# Altium project DIOT_Backplane.PrjPCB (part 2 of 3)
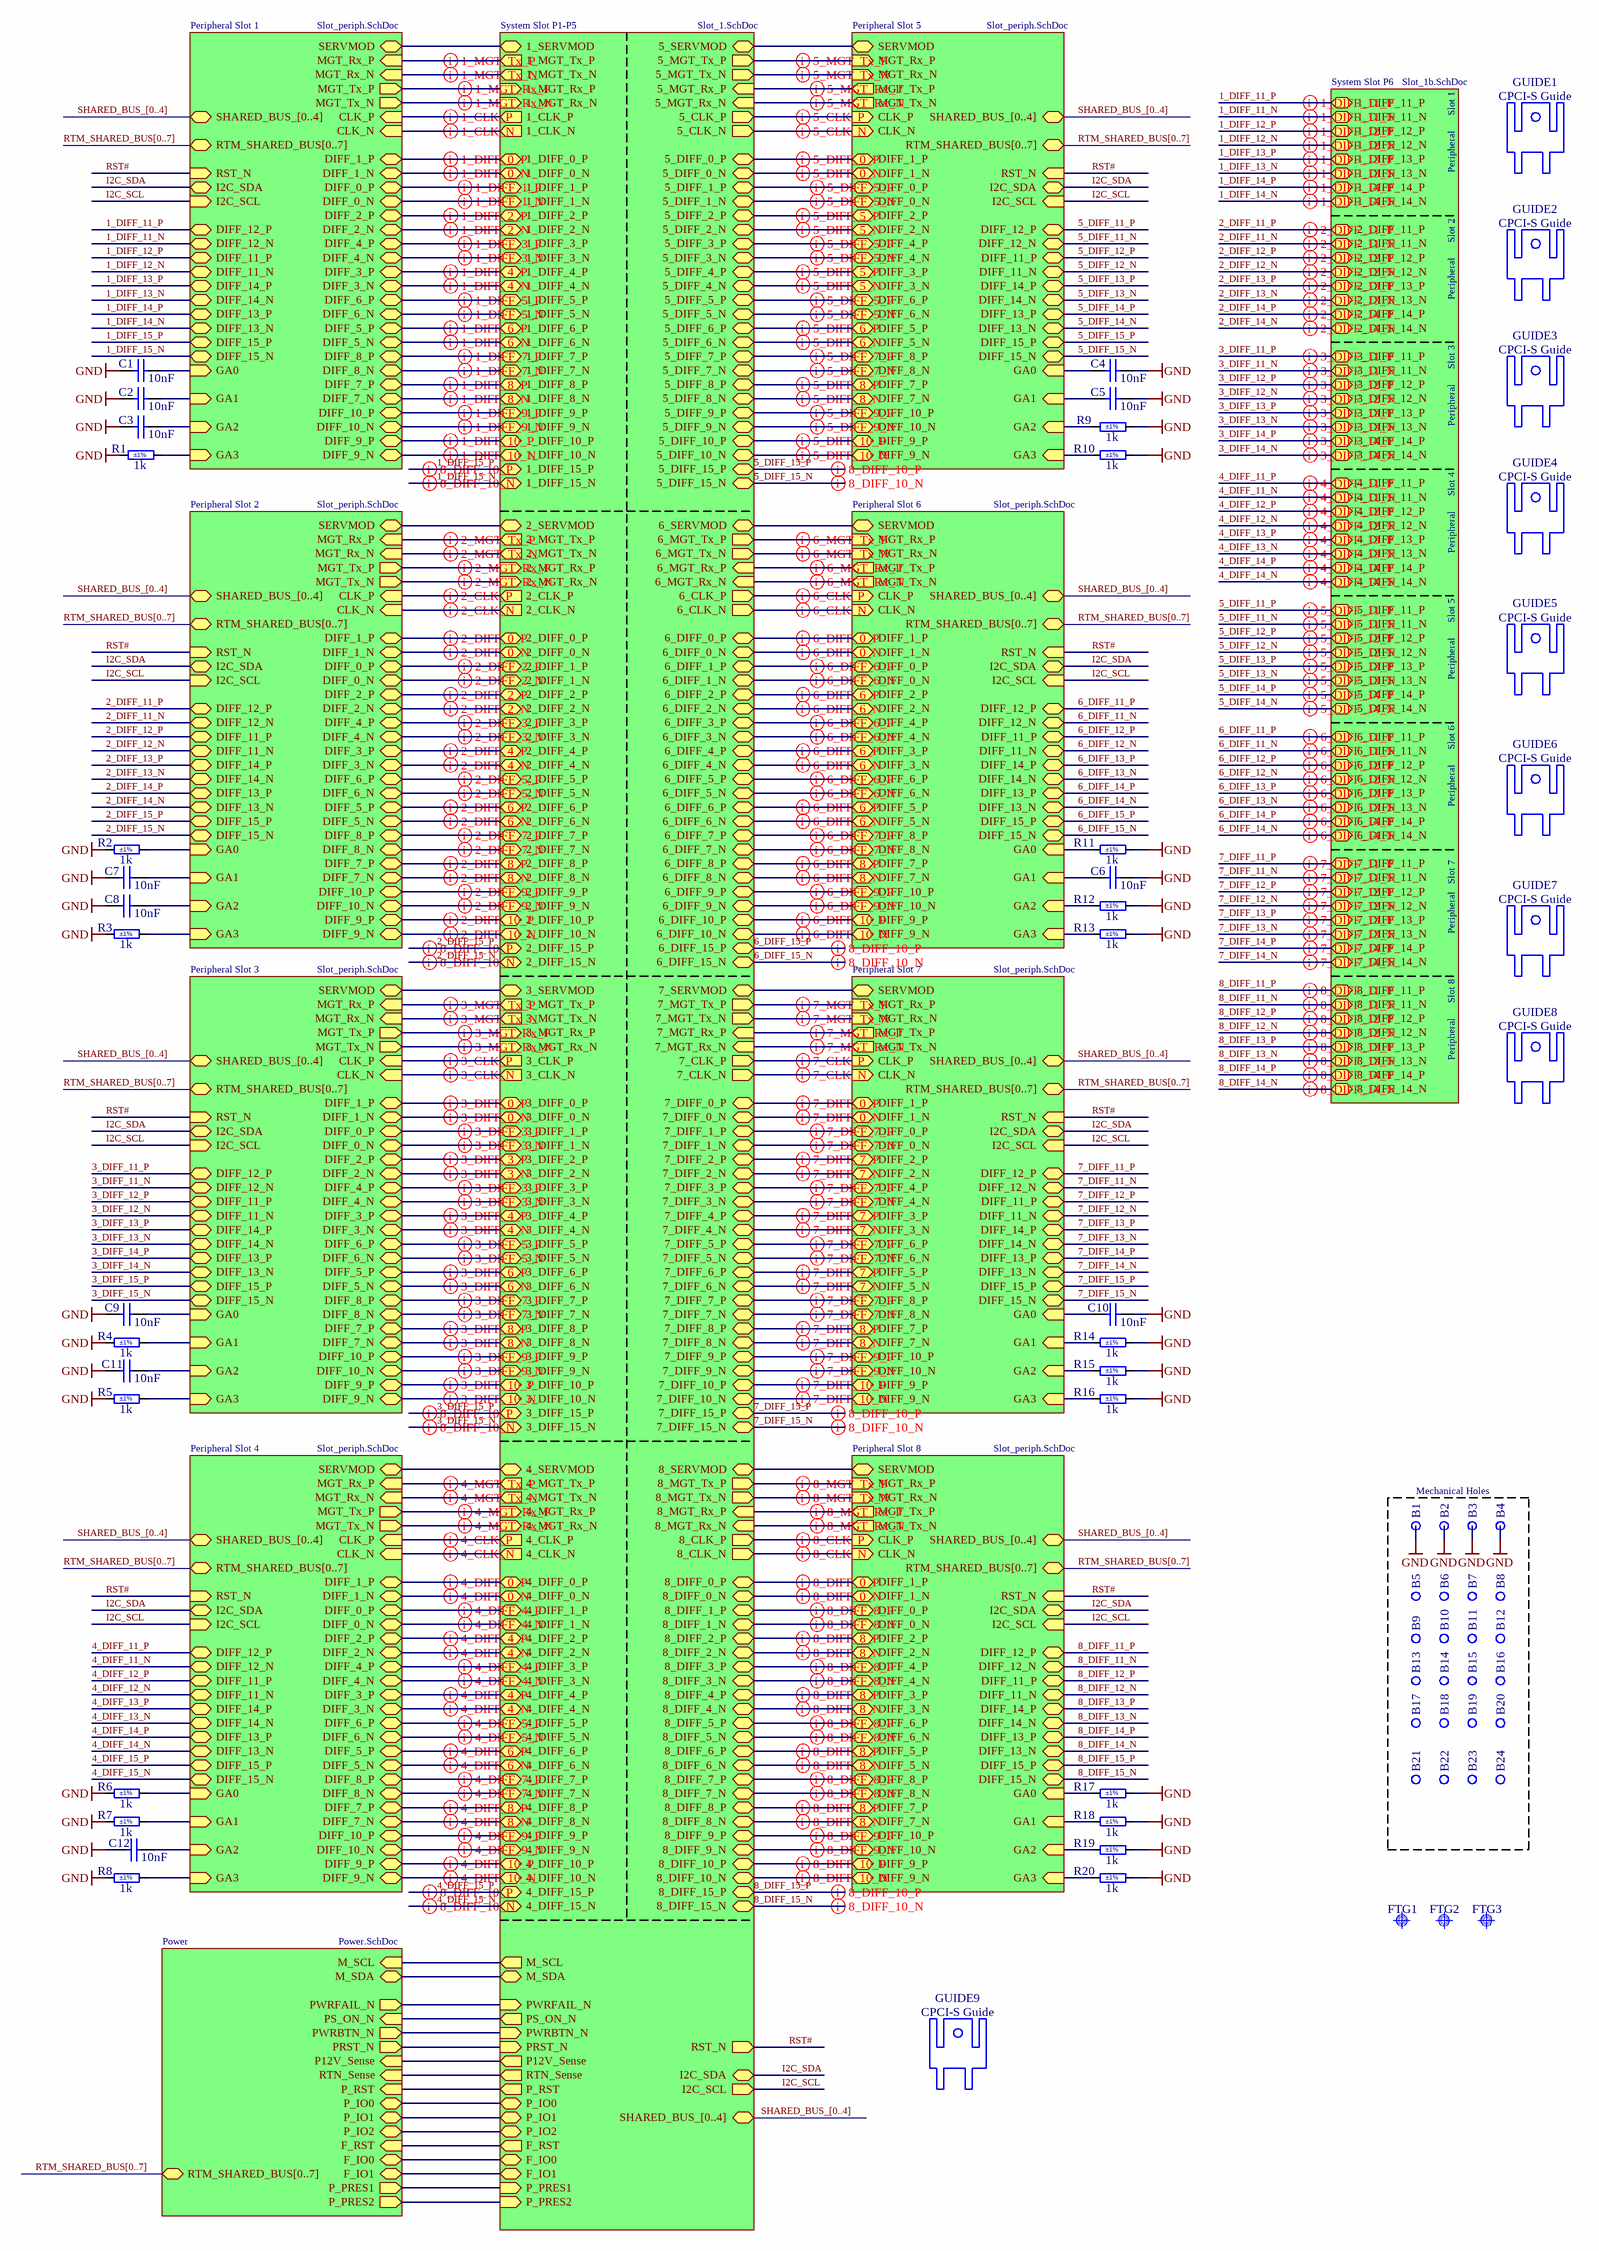
[diagram p3: DIOT_Backplane.SchDoc]

## Sheet DIOT_Backplane.SchDoc: =title_ (continued)

### Nets
GND: B1.1 B2.1 B3.1 B4.1 C1.1 C2.1 C3.1 C4.2 C5.2 C6.2 C7.1 C8.1 C9.1 C10.2 C11.1 C12.1 R1.1 R2.1 R3.1 R4.1 R5.1 R6.1 R7.1 R8.1 R9.2 R10.2 R11.2 R12.2 R13.2 R14.2 R15.2 R16.2 R17.2 R18.2 R19.2 R20.2
1_DIFF_11_N: sheet System Slot P6/1_DIFF_11_N, sheet Peripheral Slot 1/DIFF_12_N
1_DIFF_11_P: sheet System Slot P6/1_DIFF_11_P, sheet Peripheral Slot 1/DIFF_12_P
1_DIFF_12_N: sheet System Slot P6/1_DIFF_12_N, sheet Peripheral Slot 1/DIFF_11_N
1_DIFF_12_P: sheet System Slot P6/1_DIFF_12_P, sheet Peripheral Slot 1/DIFF_11_P
1_DIFF_13_N: sheet System Slot P6/1_DIFF_13_N, sheet Peripheral Slot 1/DIFF_14_N
1_DIFF_13_P: sheet System Slot P6/1_DIFF_13_P, sheet Peripheral Slot 1/DIFF_14_P
1_DIFF_14_N: sheet System Slot P6/1_DIFF_14_N, sheet Peripheral Slot 1/DIFF_13_N
1_DIFF_14_P: sheet System Slot P6/1_DIFF_14_P, sheet Peripheral Slot 1/DIFF_13_P
1_DIFF_15_N: sheet System Slot P1-P5/1_DIFF_15_N, sheet Peripheral Slot 1/DIFF_15_N
1_DIFF_15_P: sheet System Slot P1-P5/1_DIFF_15_P, sheet Peripheral Slot 1/DIFF_15_P
2_DIFF_11_N: sheet System Slot P6/2_DIFF_11_N, sheet Peripheral Slot 2/DIFF_12_N
2_DIFF_11_P: sheet System Slot P6/2_DIFF_11_P, sheet Peripheral Slot 2/DIFF_12_P
2_DIFF_12_N: sheet System Slot P6/2_DIFF_12_N, sheet Peripheral Slot 2/DIFF_11_N
2_DIFF_12_P: sheet System Slot P6/2_DIFF_12_P, sheet Peripheral Slot 2/DIFF_11_P
2_DIFF_13_N: sheet System Slot P6/2_DIFF_13_N, sheet Peripheral Slot 2/DIFF_14_N
2_DIFF_13_P: sheet System Slot P6/2_DIFF_13_P, sheet Peripheral Slot 2/DIFF_14_P
2_DIFF_14_N: sheet System Slot P6/2_DIFF_14_N, sheet Peripheral Slot 2/DIFF_13_N
2_DIFF_14_P: sheet System Slot P6/2_DIFF_14_P, sheet Peripheral Slot 2/DIFF_13_P
2_DIFF_15_N: sheet System Slot P1-P5/2_DIFF_15_N, sheet Peripheral Slot 2/DIFF_15_N
2_DIFF_15_P: sheet System Slot P1-P5/2_DIFF_15_P, sheet Peripheral Slot 2/DIFF_15_P
3_DIFF_11_N: sheet System Slot P6/3_DIFF_11_N, sheet Peripheral Slot 3/DIFF_12_N
3_DIFF_11_P: sheet System Slot P6/3_DIFF_11_P, sheet Peripheral Slot 3/DIFF_12_P
3_DIFF_12_N: sheet System Slot P6/3_DIFF_12_N, sheet Peripheral Slot 3/DIFF_11_N
3_DIFF_12_P: sheet System Slot P6/3_DIFF_12_P, sheet Peripheral Slot 3/DIFF_11_P
3_DIFF_13_N: sheet System Slot P6/3_DIFF_13_N, sheet Peripheral Slot 3/DIFF_14_N
3_DIFF_13_P: sheet System Slot P6/3_DIFF_13_P, sheet Peripheral Slot 3/DIFF_14_P
3_DIFF_14_N: sheet System Slot P6/3_DIFF_14_N, sheet Peripheral Slot 3/DIFF_13_N
3_DIFF_14_P: sheet System Slot P6/3_DIFF_14_P, sheet Peripheral Slot 3/DIFF_13_P
3_DIFF_15_N: sheet System Slot P1-P5/3_DIFF_15_N, sheet Peripheral Slot 3/DIFF_15_N
3_DIFF_15_P: sheet System Slot P1-P5/3_DIFF_15_P, sheet Peripheral Slot 3/DIFF_15_P
4_DIFF_11_N: sheet System Slot P6/4_DIFF_11_N, sheet Peripheral Slot 4/DIFF_12_N
4_DIFF_11_P: sheet System Slot P6/4_DIFF_11_P, sheet Peripheral Slot 4/DIFF_12_P
4_DIFF_12_N: sheet System Slot P6/4_DIFF_12_N, sheet Peripheral Slot 4/DIFF_11_N
4_DIFF_12_P: sheet System Slot P6/4_DIFF_12_P, sheet Peripheral Slot 4/DIFF_11_P
4_DIFF_13_N: sheet System Slot P6/4_DIFF_13_N, sheet Peripheral Slot 4/DIFF_14_N
4_DIFF_13_P: sheet System Slot P6/4_DIFF_13_P, sheet Peripheral Slot 4/DIFF_14_P
4_DIFF_14_N: sheet System Slot P6/4_DIFF_14_N, sheet Peripheral Slot 4/DIFF_13_N
4_DIFF_14_P: sheet System Slot P6/4_DIFF_14_P, sheet Peripheral Slot 4/DIFF_13_P
4_DIFF_15_N: sheet System Slot P1-P5/4_DIFF_15_N, sheet Peripheral Slot 4/DIFF_15_N
4_DIFF_15_P: sheet System Slot P1-P5/4_DIFF_15_P, sheet Peripheral Slot 4/DIFF_15_P
5_DIFF_11_N: sheet System Slot P6/5_DIFF_11_N, sheet Peripheral Slot 5/DIFF_12_N
5_DIFF_11_P: sheet System Slot P6/5_DIFF_11_P, sheet Peripheral Slot 5/DIFF_12_P
5_DIFF_12_N: sheet System Slot P6/5_DIFF_12_N, sheet Peripheral Slot 5/DIFF_11_N
5_DIFF_12_P: sheet System Slot P6/5_DIFF_12_P, sheet Peripheral Slot 5/DIFF_11_P
5_DIFF_13_N: sheet System Slot P6/5_DIFF_13_N, sheet Peripheral Slot 5/DIFF_14_N
5_DIFF_13_P: sheet System Slot P6/5_DIFF_13_P, sheet Peripheral Slot 5/DIFF_14_P
5_DIFF_14_N: sheet System Slot P6/5_DIFF_14_N, sheet Peripheral Slot 5/DIFF_13_N
5_DIFF_14_P: sheet System Slot P6/5_DIFF_14_P, sheet Peripheral Slot 5/DIFF_13_P
5_DIFF_15_N: sheet System Slot P1-P5/5_DIFF_15_N, sheet Peripheral Slot 5/DIFF_15_N
5_DIFF_15_P: sheet System Slot P1-P5/5_DIFF_15_P, sheet Peripheral Slot 5/DIFF_15_P
6_DIFF_11_N: sheet System Slot P6/6_DIFF_11_N, sheet Peripheral Slot 6/DIFF_12_N
6_DIFF_11_P: sheet System Slot P6/6_DIFF_11_P, sheet Peripheral Slot 6/DIFF_12_P
6_DIFF_12_N: sheet System Slot P6/6_DIFF_12_N, sheet Peripheral Slot 6/DIFF_11_N
6_DIFF_12_P: sheet System Slot P6/6_DIFF_12_P, sheet Peripheral Slot 6/DIFF_11_P
6_DIFF_13_N: sheet System Slot P6/6_DIFF_13_N, sheet Peripheral Slot 6/DIFF_14_N
6_DIFF_13_P: sheet System Slot P6/6_DIFF_13_P, sheet Peripheral Slot 6/DIFF_14_P
6_DIFF_14_N: sheet System Slot P6/6_DIFF_14_N, sheet Peripheral Slot 6/DIFF_13_N
6_DIFF_14_P: sheet System Slot P6/6_DIFF_14_P, sheet Peripheral Slot 6/DIFF_13_P
6_DIFF_15_N: sheet System Slot P1-P5/6_DIFF_15_N, sheet Peripheral Slot 6/DIFF_15_N
6_DIFF_15_P: sheet System Slot P1-P5/6_DIFF_15_P, sheet Peripheral Slot 6/DIFF_15_P
7_DIFF_11_N: sheet System Slot P6/7_DIFF_11_N, sheet Peripheral Slot 7/DIFF_12_N
7_DIFF_11_P: sheet System Slot P6/7_DIFF_11_P, sheet Peripheral Slot 7/DIFF_12_P
7_DIFF_12_N: sheet System Slot P6/7_DIFF_12_N, sheet Peripheral Slot 7/DIFF_11_N
7_DIFF_12_P: sheet System Slot P6/7_DIFF_12_P, sheet Peripheral Slot 7/DIFF_11_P
7_DIFF_13_N: sheet System Slot P6/7_DIFF_13_N, sheet Peripheral Slot 7/DIFF_14_N
7_DIFF_13_P: sheet System Slot P6/7_DIFF_13_P, sheet Peripheral Slot 7/DIFF_14_P
7_DIFF_14_N: sheet System Slot P6/7_DIFF_14_N, sheet Peripheral Slot 7/DIFF_13_N
7_DIFF_14_P: sheet System Slot P6/7_DIFF_14_P, sheet Peripheral Slot 7/DIFF_13_P
7_DIFF_15_N: sheet System Slot P1-P5/7_DIFF_15_N, sheet Peripheral Slot 7/DIFF_15_N
7_DIFF_15_P: sheet System Slot P1-P5/7_DIFF_15_P, sheet Peripheral Slot 7/DIFF_15_P
8_DIFF_11_N: sheet System Slot P6/8_DIFF_11_N, sheet Peripheral Slot 8/DIFF_12_N
8_DIFF_11_P: sheet System Slot P6/8_DIFF_11_P, sheet Peripheral Slot 8/DIFF_12_P
8_DIFF_12_N: sheet System Slot P6/8_DIFF_12_N, sheet Peripheral Slot 8/DIFF_11_N
8_DIFF_12_P: sheet System Slot P6/8_DIFF_12_P, sheet Peripheral Slot 8/DIFF_11_P
8_DIFF_13_N: sheet System Slot P6/8_DIFF_13_N, sheet Peripheral Slot 8/DIFF_14_N
8_DIFF_13_P: sheet System Slot P6/8_DIFF_13_P, sheet Peripheral Slot 8/DIFF_14_P
8_DIFF_14_N: sheet System Slot P6/8_DIFF_14_N, sheet Peripheral Slot 8/DIFF_13_N
8_DIFF_14_P: sheet System Slot P6/8_DIFF_14_P, sheet Peripheral Slot 8/DIFF_13_P
8_DIFF_15_N: sheet System Slot P1-P5/8_DIFF_15_N, sheet Peripheral Slot 8/DIFF_15_N
8_DIFF_15_P: sheet System Slot P1-P5/8_DIFF_15_P, sheet Peripheral Slot 8/DIFF_15_P
F_IO0: sheet Power/F_IO0, sheet System Slot P1-P5/F_IO0
F_IO1: sheet Power/F_IO1, sheet System Slot P1-P5/F_IO1
F_RST: sheet Power/F_RST, sheet System Slot P1-P5/F_RST
I2C_SCL: sheet System Slot P1-P5/I2C_SCL, sheet Peripheral Slot 3/I2C_SCL, sheet Peripheral Slot 4/I2C_SCL, sheet Peripheral Slot 6/I2C_SCL, sheet Peripheral Slot 7/I2C_SCL, sheet Peripheral Slot 8/I2C_SCL, sheet Peripheral Slot 2/I2C_SCL, sheet Peripheral Slot 5/I2C_SCL, sheet Peripheral Slot 1/I2C_SCL
I2C_SDA: sheet System Slot P1-P5/I2C_SDA, sheet Peripheral Slot 3/I2C_SDA, sheet Peripheral Slot 4/I2C_SDA, sheet Peripheral Slot 6/I2C_SDA, sheet Peripheral Slot 7/I2C_SDA, sheet Peripheral Slot 8/I2C_SDA, sheet Peripheral Slot 2/I2C_SDA, sheet Peripheral Slot 5/I2C_SDA, sheet Peripheral Slot 1/I2C_SDA
M_SCL: sheet Power/M_SCL, sheet System Slot P1-P5/M_SCL
M_SDA: sheet Power/M_SDA, sheet System Slot P1-P5/M_SDA
P12V_Sense: sheet Power/P12V_Sense, sheet System Slot P1-P5/P12V_Sense
P_IO0: sheet Power/P_IO0, sheet System Slot P1-P5/P_IO0
P_IO1: sheet Power/P_IO1, sheet System Slot P1-P5/P_IO1
P_IO2: sheet Power/P_IO2, sheet System Slot P1-P5/P_IO2
P_PRES1: sheet Power/P_PRES1, sheet System Slot P1-P5/P_PRES1
P_PRES2: sheet Power/P_PRES2, sheet System Slot P1-P5/P_PRES2
P_RST: sheet Power/P_RST, sheet System Slot P1-P5/P_RST
PRST_N: sheet Power/PRST_N, sheet System Slot P1-P5/PRST_N
PS_ON_N: sheet Power/PS_ON_N, sheet System Slot P1-P5/PS_ON_N
PWRBTN_N: sheet Power/PWRBTN_N, sheet System Slot P1-P5/PWRBTN_N
PWRFAIL_N: sheet Power/PWRFAIL_N, sheet System Slot P1-P5/PWRFAIL_N
RST#: sheet System Slot P1-P5/RST_N, sheet Peripheral Slot 3/RST_N, sheet Peripheral Slot 4/RST_N, sheet Peripheral Slot 6/RST_N, sheet Peripheral Slot 7/RST_N, sheet Peripheral Slot 8/RST_N, sheet Peripheral Slot 2/RST_N, sheet Peripheral Slot 5/RST_N, sheet Peripheral Slot 1/RST_N
RTN_Sense: sheet Power/RTN_Sense, sheet System Slot P1-P5/RTN_Sense
NetC1_2: C1.2 ; sheet Peripheral Slot 1/GA0
NetC2_2: C2.2 ; sheet Peripheral Slot 1/GA1
NetC3_2: C3.2 ; sheet Peripheral Slot 1/GA2
NetC4_1: C4.1 ; sheet Peripheral Slot 5/GA0
NetC5_1: C5.1 ; sheet Peripheral Slot 5/GA1
NetC6_1: C6.1 ; sheet Peripheral Slot 6/GA1
NetC7_2: C7.2 ; sheet Peripheral Slot 2/GA1
NetC8_2: C8.2 ; sheet Peripheral Slot 2/GA2
NetC9_2: C9.2 ; sheet Peripheral Slot 3/GA0
NetC10_1: C10.1 ; sheet Peripheral Slot 7/GA0
NetC11_2: C11.2 ; sheet Peripheral Slot 3/GA2
NetC12_2: C12.2 ; sheet Peripheral Slot 4/GA2
NetR1_2: R1.2 ; sheet Peripheral Slot 1/GA3
NetR2_2: R2.2 ; sheet Peripheral Slot 2/GA0
NetR3_2: R3.2 ; sheet Peripheral Slot 2/GA3
NetR4_2: R4.2 ; sheet Peripheral Slot 3/GA1
NetR5_2: R5.2 ; sheet Peripheral Slot 3/GA3
NetR6_2: R6.2 ; sheet Peripheral Slot 4/GA0
NetR7_2: R7.2 ; sheet Peripheral Slot 4/GA1
NetR8_2: R8.2 ; sheet Peripheral Slot 4/GA3
NetR9_1: R9.1 ; sheet Peripheral Slot 5/GA2
NetR10_1: R10.1 ; sheet Peripheral Slot 5/GA3
NetR11_1: R11.1 ; sheet Peripheral Slot 6/GA0
NetR12_1: R12.1 ; sheet Peripheral Slot 6/GA2
NetR13_1: R13.1 ; sheet Peripheral Slot 6/GA3
NetR14_1: R14.1 ; sheet Peripheral Slot 7/GA1
NetR15_1: R15.1 ; sheet Peripheral Slot 7/GA2
NetR16_1: R16.1 ; sheet Peripheral Slot 7/GA3
NetR17_1: R17.1 ; sheet Peripheral Slot 8/GA0
NetR18_1: R18.1 ; sheet Peripheral Slot 8/GA1
NetR19_1: R19.1 ; sheet Peripheral Slot 8/GA2
NetR20_1: R20.1 ; sheet Peripheral Slot 8/GA3
(unnamed): sheet System Slot P1-P5/1_SERVMOD, sheet Peripheral Slot 1/SERVMOD
(unnamed): sheet System Slot P1-P5/2_CLK_P, sheet Peripheral Slot 2/CLK_P
(unnamed): sheet System Slot P1-P5/2_CLK_N, sheet Peripheral Slot 2/CLK_N
(unnamed): sheet System Slot P1-P5/2_SERVMOD, sheet Peripheral Slot 2/SERVMOD
(unnamed): sheet System Slot P1-P5/3_CLK_P, sheet Peripheral Slot 3/CLK_P
(unnamed): sheet System Slot P1-P5/3_CLK_N, sheet Peripheral Slot 3/CLK_N
(unnamed): sheet System Slot P1-P5/3_SERVMOD, sheet Peripheral Slot 3/SERVMOD
(unnamed): sheet System Slot P1-P5/4_CLK_P, sheet Peripheral Slot 4/CLK_P
(unnamed): sheet System Slot P1-P5/4_CLK_N, sheet Peripheral Slot 4/CLK_N
(unnamed): sheet System Slot P1-P5/4_SERVMOD, sheet Peripheral Slot 4/SERVMOD
(unnamed): sheet System Slot P1-P5/5_SERVMOD, sheet Peripheral Slot 5/SERVMOD
(unnamed): sheet System Slot P1-P5/5_CLK_P, sheet Peripheral Slot 5/CLK_P
(unnamed): sheet System Slot P1-P5/6_SERVMOD, sheet Peripheral Slot 6/SERVMOD
(unnamed): sheet System Slot P1-P5/5_CLK_N, sheet Peripheral Slot 5/CLK_N
(unnamed): sheet System Slot P1-P5/6_CLK_P, sheet Peripheral Slot 6/CLK_P
(unnamed): sheet System Slot P1-P5/6_CLK_N, sheet Peripheral Slot 6/CLK_N
(unnamed): sheet System Slot P1-P5/7_SERVMOD, sheet Peripheral Slot 7/SERVMOD
(unnamed): sheet System Slot P1-P5/7_CLK_P, sheet Peripheral Slot 7/CLK_P
(unnamed): sheet System Slot P1-P5/7_CLK_N, sheet Peripheral Slot 7/CLK_N
(unnamed): sheet System Slot P1-P5/8_SERVMOD, sheet Peripheral Slot 8/SERVMOD
(unnamed): sheet System Slot P1-P5/8_CLK_P, sheet Peripheral Slot 8/CLK_P
(unnamed): sheet System Slot P1-P5/8_CLK_N, sheet Peripheral Slot 8/CLK_N
(unnamed): sheet System Slot P1-P5/1_CLK_N, sheet Peripheral Slot 1/CLK_N
(unnamed): sheet System Slot P1-P5/1_CLK_P, sheet Peripheral Slot 1/CLK_P
(unnamed): sheet System Slot P1-P5/2_DIFF_0_P, sheet Peripheral Slot 2/DIFF_1_P
(unnamed): sheet System Slot P1-P5/2_DIFF_0_N, sheet Peripheral Slot 2/DIFF_1_N
(unnamed): sheet System Slot P1-P5/2_DIFF_1_P, sheet Peripheral Slot 2/DIFF_0_P
(unnamed): sheet System Slot P1-P5/2_DIFF_1_N, sheet Peripheral Slot 2/DIFF_0_N
(unnamed): sheet System Slot P1-P5/3_DIFF_0_P, sheet Peripheral Slot 3/DIFF_1_P
(unnamed): sheet System Slot P1-P5/3_DIFF_0_N, sheet Peripheral Slot 3/DIFF_1_N
(unnamed): sheet System Slot P1-P5/3_DIFF_1_P, sheet Peripheral Slot 3/DIFF_0_P
(unnamed): sheet System Slot P1-P5/3_DIFF_1_N, sheet Peripheral Slot 3/DIFF_0_N
(unnamed): sheet System Slot P1-P5/4_DIFF_0_P, sheet Peripheral Slot 4/DIFF_1_P
(unnamed): sheet System Slot P1-P5/4_DIFF_0_N, sheet Peripheral Slot 4/DIFF_1_N
(unnamed): sheet System Slot P1-P5/4_DIFF_1_P, sheet Peripheral Slot 4/DIFF_0_P
(unnamed): sheet System Slot P1-P5/4_DIFF_1_N, sheet Peripheral Slot 4/DIFF_0_N
(unnamed): sheet System Slot P1-P5/5_DIFF_0_P, sheet Peripheral Slot 5/DIFF_1_P
(unnamed): sheet System Slot P1-P5/5_DIFF_0_N, sheet Peripheral Slot 5/DIFF_1_N
(unnamed): sheet System Slot P1-P5/5_DIFF_1_P, sheet Peripheral Slot 5/DIFF_0_P
(unnamed): sheet System Slot P1-P5/5_DIFF_1_N, sheet Peripheral Slot 5/DIFF_0_N
(unnamed): sheet System Slot P1-P5/6_DIFF_0_P, sheet Peripheral Slot 6/DIFF_1_P
(unnamed): sheet System Slot P1-P5/6_DIFF_0_N, sheet Peripheral Slot 6/DIFF_1_N
(unnamed): sheet System Slot P1-P5/6_DIFF_1_P, sheet Peripheral Slot 6/DIFF_0_P
(unnamed): sheet System Slot P1-P5/6_DIFF_1_N, sheet Peripheral Slot 6/DIFF_0_N
(unnamed): sheet System Slot P1-P5/7_DIFF_0_P, sheet Peripheral Slot 7/DIFF_1_P
(unnamed): sheet System Slot P1-P5/7_DIFF_0_N, sheet Peripheral Slot 7/DIFF_1_N
(unnamed): sheet System Slot P1-P5/7_DIFF_1_P, sheet Peripheral Slot 7/DIFF_0_P
(unnamed): sheet System Slot P1-P5/7_DIFF_1_N, sheet Peripheral Slot 7/DIFF_0_N
(unnamed): sheet System Slot P1-P5/8_DIFF_0_P, sheet Peripheral Slot 8/DIFF_1_P
(unnamed): sheet System Slot P1-P5/8_DIFF_0_N, sheet Peripheral Slot 8/DIFF_1_N
(unnamed): sheet System Slot P1-P5/1_DIFF_0_P, sheet Peripheral Slot 1/DIFF_1_P
(unnamed): sheet System Slot P1-P5/1_DIFF_0_N, sheet Peripheral Slot 1/DIFF_1_N
(unnamed): sheet System Slot P1-P5/1_DIFF_1_P, sheet Peripheral Slot 1/DIFF_0_P
(unnamed): sheet System Slot P1-P5/1_DIFF_1_N, sheet Peripheral Slot 1/DIFF_0_N
(unnamed): sheet System Slot P1-P5/8_DIFF_1_N, sheet Peripheral Slot 8/DIFF_0_N
(unnamed): sheet System Slot P1-P5/8_DIFF_1_P, sheet Peripheral Slot 8/DIFF_0_P
(unnamed): sheet System Slot P1-P5/2_DIFF_2_P, sheet Peripheral Slot 2/DIFF_2_P
(unnamed): sheet System Slot P1-P5/2_DIFF_2_N, sheet Peripheral Slot 2/DIFF_2_N
(unnamed): sheet System Slot P1-P5/3_DIFF_2_P, sheet Peripheral Slot 3/DIFF_2_P
(unnamed): sheet System Slot P1-P5/3_DIFF_2_N, sheet Peripheral Slot 3/DIFF_2_N
(unnamed): sheet System Slot P1-P5/4_DIFF_2_P, sheet Peripheral Slot 4/DIFF_2_P
(unnamed): sheet System Slot P1-P5/4_DIFF_2_N, sheet Peripheral Slot 4/DIFF_2_N
(unnamed): sheet System Slot P1-P5/5_DIFF_2_P, sheet Peripheral Slot 5/DIFF_2_P
(unnamed): sheet System Slot P1-P5/5_DIFF_2_N, sheet Peripheral Slot 5/DIFF_2_N
(unnamed): sheet System Slot P1-P5/6_DIFF_2_P, sheet Peripheral Slot 6/DIFF_2_P
(unnamed): sheet System Slot P1-P5/6_DIFF_2_N, sheet Peripheral Slot 6/DIFF_2_N
(unnamed): sheet System Slot P1-P5/7_DIFF_2_P, sheet Peripheral Slot 7/DIFF_2_P
(unnamed): sheet System Slot P1-P5/7_DIFF_2_N, sheet Peripheral Slot 7/DIFF_2_N
(unnamed): sheet System Slot P1-P5/8_DIFF_2_P, sheet Peripheral Slot 8/DIFF_2_P
(unnamed): sheet System Slot P1-P5/8_DIFF_2_N, sheet Peripheral Slot 8/DIFF_2_N
(unnamed): sheet System Slot P1-P5/1_DIFF_2_P, sheet Peripheral Slot 1/DIFF_2_P
(unnamed): sheet System Slot P1-P5/1_DIFF_2_N, sheet Peripheral Slot 1/DIFF_2_N
(unnamed): sheet System Slot P1-P5/2_DIFF_3_N, sheet Peripheral Slot 2/DIFF_4_N
(unnamed): sheet System Slot P1-P5/2_DIFF_3_P, sheet Peripheral Slot 2/DIFF_4_P
(unnamed): sheet System Slot P1-P5/3_DIFF_3_N, sheet Peripheral Slot 3/DIFF_4_N
(unnamed): sheet System Slot P1-P5/3_DIFF_3_P, sheet Peripheral Slot 3/DIFF_4_P
(unnamed): sheet System Slot P1-P5/4_DIFF_3_N, sheet Peripheral Slot 4/DIFF_4_N
(unnamed): sheet System Slot P1-P5/4_DIFF_3_P, sheet Peripheral Slot 4/DIFF_4_P
(unnamed): sheet System Slot P1-P5/5_DIFF_3_N, sheet Peripheral Slot 5/DIFF_4_N
(unnamed): sheet System Slot P1-P5/5_DIFF_3_P, sheet Peripheral Slot 5/DIFF_4_P
(unnamed): sheet System Slot P1-P5/6_DIFF_3_N, sheet Peripheral Slot 6/DIFF_4_N
(unnamed): sheet System Slot P1-P5/6_DIFF_3_P, sheet Peripheral Slot 6/DIFF_4_P
(unnamed): sheet System Slot P1-P5/7_DIFF_3_N, sheet Peripheral Slot 7/DIFF_4_N
(unnamed): sheet System Slot P1-P5/7_DIFF_3_P, sheet Peripheral Slot 7/DIFF_4_P
(unnamed): sheet System Slot P1-P5/8_DIFF_3_N, sheet Peripheral Slot 8/DIFF_4_N
(unnamed): sheet System Slot P1-P5/8_DIFF_3_P, sheet Peripheral Slot 8/DIFF_4_P
(unnamed): sheet System Slot P1-P5/1_DIFF_3_N, sheet Peripheral Slot 1/DIFF_4_N
(unnamed): sheet System Slot P1-P5/1_DIFF_3_P, sheet Peripheral Slot 1/DIFF_4_P
(unnamed): sheet System Slot P1-P5/2_DIFF_4_N, sheet Peripheral Slot 2/DIFF_3_N
(unnamed): sheet System Slot P1-P5/2_DIFF_4_P, sheet Peripheral Slot 2/DIFF_3_P
(unnamed): sheet System Slot P1-P5/3_DIFF_4_N, sheet Peripheral Slot 3/DIFF_3_N
(unnamed): sheet System Slot P1-P5/3_DIFF_4_P, sheet Peripheral Slot 3/DIFF_3_P
(unnamed): sheet System Slot P1-P5/4_DIFF_4_N, sheet Peripheral Slot 4/DIFF_3_N
(unnamed): sheet System Slot P1-P5/4_DIFF_4_P, sheet Peripheral Slot 4/DIFF_3_P
(unnamed): sheet System Slot P1-P5/5_DIFF_4_N, sheet Peripheral Slot 5/DIFF_3_N
(unnamed): sheet System Slot P1-P5/5_DIFF_4_P, sheet Peripheral Slot 5/DIFF_3_P
(unnamed): sheet System Slot P1-P5/6_DIFF_4_N, sheet Peripheral Slot 6/DIFF_3_N
(unnamed): sheet System Slot P1-P5/6_DIFF_4_P, sheet Peripheral Slot 6/DIFF_3_P
(unnamed): sheet System Slot P1-P5/7_DIFF_4_N, sheet Peripheral Slot 7/DIFF_3_N
(unnamed): sheet System Slot P1-P5/7_DIFF_4_P, sheet Peripheral Slot 7/DIFF_3_P
(unnamed): sheet System Slot P1-P5/8_DIFF_4_N, sheet Peripheral Slot 8/DIFF_3_N
(unnamed): sheet System Slot P1-P5/8_DIFF_4_P, sheet Peripheral Slot 8/DIFF_3_P
(unnamed): sheet System Slot P1-P5/1_DIFF_4_N, sheet Peripheral Slot 1/DIFF_3_N
(unnamed): sheet System Slot P1-P5/1_DIFF_4_P, sheet Peripheral Slot 1/DIFF_3_P
(unnamed): sheet System Slot P1-P5/3_DIFF_5_P, sheet Peripheral Slot 3/DIFF_6_P
(unnamed): sheet System Slot P1-P5/3_DIFF_5_N, sheet Peripheral Slot 3/DIFF_6_N
(unnamed): sheet System Slot P1-P5/4_DIFF_5_P, sheet Peripheral Slot 4/DIFF_6_P
(unnamed): sheet System Slot P1-P5/4_DIFF_5_N, sheet Peripheral Slot 4/DIFF_6_N
(unnamed): sheet System Slot P1-P5/5_DIFF_5_P, sheet Peripheral Slot 5/DIFF_6_P
(unnamed): sheet System Slot P1-P5/5_DIFF_5_N, sheet Peripheral Slot 5/DIFF_6_N
(unnamed): sheet System Slot P1-P5/6_DIFF_5_P, sheet Peripheral Slot 6/DIFF_6_P
(unnamed): sheet System Slot P1-P5/6_DIFF_5_N, sheet Peripheral Slot 6/DIFF_6_N
(unnamed): sheet System Slot P1-P5/7_DIFF_5_P, sheet Peripheral Slot 7/DIFF_6_P
(unnamed): sheet System Slot P1-P5/7_DIFF_5_N, sheet Peripheral Slot 7/DIFF_6_N
(unnamed): sheet System Slot P1-P5/8_DIFF_5_P, sheet Peripheral Slot 8/DIFF_6_P
(unnamed): sheet System Slot P1-P5/8_DIFF_5_N, sheet Peripheral Slot 8/DIFF_6_N
(unnamed): sheet System Slot P1-P5/1_DIFF_5_P, sheet Peripheral Slot 1/DIFF_6_P
(unnamed): sheet System Slot P1-P5/1_DIFF_5_N, sheet Peripheral Slot 1/DIFF_6_N
(unnamed): sheet System Slot P1-P5/2_DIFF_6_P, sheet Peripheral Slot 2/DIFF_5_P
(unnamed): sheet System Slot P1-P5/2_DIFF_6_N, sheet Peripheral Slot 2/DIFF_5_N
(unnamed): sheet System Slot P1-P5/3_DIFF_6_P, sheet Peripheral Slot 3/DIFF_5_P
(unnamed): sheet System Slot P1-P5/3_DIFF_6_N, sheet Peripheral Slot 3/DIFF_5_N
(unnamed): sheet System Slot P1-P5/4_DIFF_6_P, sheet Peripheral Slot 4/DIFF_5_P
(unnamed): sheet System Slot P1-P5/4_DIFF_6_N, sheet Peripheral Slot 4/DIFF_5_N
(unnamed): sheet System Slot P1-P5/6_DIFF_6_P, sheet Peripheral Slot 6/DIFF_5_P
(unnamed): sheet System Slot P1-P5/6_DIFF_6_N, sheet Peripheral Slot 6/DIFF_5_N
(unnamed): sheet System Slot P1-P5/7_DIFF_6_P, sheet Peripheral Slot 7/DIFF_5_P
(unnamed): sheet System Slot P1-P5/7_DIFF_6_N, sheet Peripheral Slot 7/DIFF_5_N
(unnamed): sheet System Slot P1-P5/8_DIFF_6_P, sheet Peripheral Slot 8/DIFF_5_P
(unnamed): sheet System Slot P1-P5/8_DIFF_6_N, sheet Peripheral Slot 8/DIFF_5_N
(unnamed): sheet System Slot P1-P5/1_DIFF_6_P, sheet Peripheral Slot 1/DIFF_5_P
(unnamed): sheet System Slot P1-P5/1_DIFF_6_N, sheet Peripheral Slot 1/DIFF_5_N
(unnamed): sheet System Slot P1-P5/5_DIFF_6_N, sheet Peripheral Slot 5/DIFF_5_N
(unnamed): sheet System Slot P1-P5/5_DIFF_6_P, sheet Peripheral Slot 5/DIFF_5_P
(unnamed): sheet System Slot P1-P5/2_DIFF_5_N, sheet Peripheral Slot 2/DIFF_6_N
(unnamed): sheet System Slot P1-P5/2_DIFF_5_P, sheet Peripheral Slot 2/DIFF_6_P
(unnamed): sheet System Slot P1-P5/2_DIFF_7_P, sheet Peripheral Slot 2/DIFF_8_P
(unnamed): sheet System Slot P1-P5/2_DIFF_7_N, sheet Peripheral Slot 2/DIFF_8_N
(unnamed): sheet System Slot P1-P5/3_DIFF_7_P, sheet Peripheral Slot 3/DIFF_8_P
(unnamed): sheet System Slot P1-P5/3_DIFF_7_N, sheet Peripheral Slot 3/DIFF_8_N
(unnamed): sheet System Slot P1-P5/4_DIFF_7_P, sheet Peripheral Slot 4/DIFF_8_P
(unnamed): sheet System Slot P1-P5/4_DIFF_7_N, sheet Peripheral Slot 4/DIFF_8_N
(unnamed): sheet System Slot P1-P5/5_DIFF_7_P, sheet Peripheral Slot 5/DIFF_8_P
(unnamed): sheet System Slot P1-P5/5_DIFF_7_N, sheet Peripheral Slot 5/DIFF_8_N
(unnamed): sheet System Slot P1-P5/6_DIFF_7_P, sheet Peripheral Slot 6/DIFF_8_P
(unnamed): sheet System Slot P1-P5/6_DIFF_7_N, sheet Peripheral Slot 6/DIFF_8_N
(unnamed): sheet System Slot P1-P5/7_DIFF_7_P, sheet Peripheral Slot 7/DIFF_8_P
(unnamed): sheet System Slot P1-P5/7_DIFF_7_N, sheet Peripheral Slot 7/DIFF_8_N
(unnamed): sheet System Slot P1-P5/8_DIFF_7_P, sheet Peripheral Slot 8/DIFF_8_P
(unnamed): sheet System Slot P1-P5/8_DIFF_7_N, sheet Peripheral Slot 8/DIFF_8_N
(unnamed): sheet System Slot P1-P5/1_DIFF_7_P, sheet Peripheral Slot 1/DIFF_8_P
(unnamed): sheet System Slot P1-P5/1_DIFF_7_N, sheet Peripheral Slot 1/DIFF_8_N
(unnamed): sheet System Slot P1-P5/2_DIFF_8_P, sheet Peripheral Slot 2/DIFF_7_P
(unnamed): sheet System Slot P1-P5/2_DIFF_8_N, sheet Peripheral Slot 2/DIFF_7_N
(unnamed): sheet System Slot P1-P5/3_DIFF_8_P, sheet Peripheral Slot 3/DIFF_7_P
(unnamed): sheet System Slot P1-P5/3_DIFF_8_N, sheet Peripheral Slot 3/DIFF_7_N
(unnamed): sheet System Slot P1-P5/4_DIFF_8_P, sheet Peripheral Slot 4/DIFF_7_P
(unnamed): sheet System Slot P1-P5/4_DIFF_8_N, sheet Peripheral Slot 4/DIFF_7_N
(unnamed): sheet System Slot P1-P5/5_DIFF_8_P, sheet Peripheral Slot 5/DIFF_7_P
(unnamed): sheet System Slot P1-P5/5_DIFF_8_N, sheet Peripheral Slot 5/DIFF_7_N
(unnamed): sheet System Slot P1-P5/6_DIFF_8_P, sheet Peripheral Slot 6/DIFF_7_P
(unnamed): sheet System Slot P1-P5/6_DIFF_8_N, sheet Peripheral Slot 6/DIFF_7_N
(unnamed): sheet System Slot P1-P5/7_DIFF_8_P, sheet Peripheral Slot 7/DIFF_7_P
(unnamed): sheet System Slot P1-P5/7_DIFF_8_N, sheet Peripheral Slot 7/DIFF_7_N
(unnamed): sheet System Slot P1-P5/8_DIFF_8_P, sheet Peripheral Slot 8/DIFF_7_P
(unnamed): sheet System Slot P1-P5/8_DIFF_8_N, sheet Peripheral Slot 8/DIFF_7_N
(unnamed): sheet System Slot P1-P5/1_DIFF_8_P, sheet Peripheral Slot 1/DIFF_7_P
(unnamed): sheet System Slot P1-P5/1_DIFF_8_N, sheet Peripheral Slot 1/DIFF_7_N
(unnamed): sheet System Slot P1-P5/2_DIFF_9_P, sheet Peripheral Slot 2/DIFF_10_P
(unnamed): sheet System Slot P1-P5/2_DIFF_9_N, sheet Peripheral Slot 2/DIFF_10_N
(unnamed): sheet System Slot P1-P5/7_DIFF_9_P, sheet Peripheral Slot 7/DIFF_10_P
(unnamed): sheet System Slot P1-P5/7_DIFF_9_N, sheet Peripheral Slot 7/DIFF_10_N
(unnamed): sheet System Slot P1-P5/8_DIFF_9_P, sheet Peripheral Slot 8/DIFF_10_P
(unnamed): sheet System Slot P1-P5/8_DIFF_9_N, sheet Peripheral Slot 8/DIFF_10_N
(unnamed): sheet System Slot P1-P5/1_DIFF_9_P, sheet Peripheral Slot 1/DIFF_10_P
(unnamed): sheet System Slot P1-P5/1_DIFF_9_N, sheet Peripheral Slot 1/DIFF_10_N
(unnamed): sheet System Slot P1-P5/2_DIFF_10_P, sheet Peripheral Slot 2/DIFF_9_P
(unnamed): sheet System Slot P1-P5/2_DIFF_10_N, sheet Peripheral Slot 2/DIFF_9_N
(unnamed): sheet System Slot P1-P5/7_DIFF_10_P, sheet Peripheral Slot 7/DIFF_9_P
(unnamed): sheet System Slot P1-P5/7_DIFF_10_N, sheet Peripheral Slot 7/DIFF_9_N
(unnamed): sheet System Slot P1-P5/8_DIFF_10_P, sheet Peripheral Slot 8/DIFF_9_P
(unnamed): sheet System Slot P1-P5/1_DIFF_10_P, sheet Peripheral Slot 1/DIFF_9_P
(unnamed): sheet System Slot P1-P5/1_DIFF_10_N, sheet Peripheral Slot 1/DIFF_9_N
(unnamed): sheet System Slot P1-P5/3_DIFF_9_P, sheet Peripheral Slot 3/DIFF_10_P
(unnamed): sheet System Slot P1-P5/3_DIFF_9_N, sheet Peripheral Slot 3/DIFF_10_N
(unnamed): sheet System Slot P1-P5/3_DIFF_10_P, sheet Peripheral Slot 3/DIFF_9_P
(unnamed): sheet System Slot P1-P5/3_DIFF_10_N, sheet Peripheral Slot 3/DIFF_9_N
(unnamed): sheet System Slot P1-P5/4_DIFF_9_P, sheet Peripheral Slot 4/DIFF_10_P
(unnamed): sheet System Slot P1-P5/4_DIFF_9_N, sheet Peripheral Slot 4/DIFF_10_N
(unnamed): sheet System Slot P1-P5/4_DIFF_10_P, sheet Peripheral Slot 4/DIFF_9_P
(unnamed): sheet System Slot P1-P5/4_DIFF_10_N, sheet Peripheral Slot 4/DIFF_9_N
(unnamed): sheet System Slot P1-P5/5_DIFF_9_P, sheet Peripheral Slot 5/DIFF_10_P
(unnamed): sheet System Slot P1-P5/5_DIFF_9_N, sheet Peripheral Slot 5/DIFF_10_N
(unnamed): sheet System Slot P1-P5/5_DIFF_10_P, sheet Peripheral Slot 5/DIFF_9_P
(unnamed): sheet System Slot P1-P5/5_DIFF_10_N, sheet Peripheral Slot 5/DIFF_9_N
(unnamed): sheet System Slot P1-P5/6_DIFF_9_P, sheet Peripheral Slot 6/DIFF_10_P
(unnamed): sheet System Slot P1-P5/6_DIFF_9_N, sheet Peripheral Slot 6/DIFF_10_N
(unnamed): sheet System Slot P1-P5/6_DIFF_10_N, sheet Peripheral Slot 6/DIFF_9_N
(unnamed): sheet System Slot P1-P5/6_DIFF_10_P, sheet Peripheral Slot 6/DIFF_9_P
(unnamed): sheet System Slot P1-P5/7_MGT_Tx_P, sheet Peripheral Slot 7/MGT_Rx_P
(unnamed): sheet System Slot P1-P5/7_MGT_Tx_N, sheet Peripheral Slot 7/MGT_Rx_N
(unnamed): sheet System Slot P1-P5/7_MGT_Rx_P, sheet Peripheral Slot 7/MGT_Tx_P
(unnamed): sheet System Slot P1-P5/7_MGT_Rx_N, sheet Peripheral Slot 7/MGT_Tx_N
(unnamed): sheet System Slot P1-P5/8_MGT_Tx_P, sheet Peripheral Slot 8/MGT_Rx_P
(unnamed): sheet System Slot P1-P5/8_MGT_Tx_N, sheet Peripheral Slot 8/MGT_Rx_N
(unnamed): sheet System Slot P1-P5/8_MGT_Rx_P, sheet Peripheral Slot 8/MGT_Tx_P
(unnamed): sheet System Slot P1-P5/8_MGT_Rx_N, sheet Peripheral Slot 8/MGT_Tx_N
(unnamed): sheet System Slot P1-P5/2_MGT_Tx_P, sheet Peripheral Slot 2/MGT_Rx_P
(unnamed): sheet System Slot P1-P5/2_MGT_Tx_N, sheet Peripheral Slot 2/MGT_Rx_N
(unnamed): sheet System Slot P1-P5/2_MGT_Rx_P, sheet Peripheral Slot 2/MGT_Tx_P
(unnamed): sheet System Slot P1-P5/2_MGT_Rx_N, sheet Peripheral Slot 2/MGT_Tx_N
(unnamed): sheet System Slot P1-P5/1_MGT_Tx_P, sheet Peripheral Slot 1/MGT_Rx_P
(unnamed): sheet System Slot P1-P5/1_MGT_Tx_N, sheet Peripheral Slot 1/MGT_Rx_N
(unnamed): sheet System Slot P1-P5/1_MGT_Rx_P, sheet Peripheral Slot 1/MGT_Tx_P
(unnamed): sheet System Slot P1-P5/1_MGT_Rx_N, sheet Peripheral Slot 1/MGT_Tx_N
(unnamed): sheet System Slot P1-P5/3_MGT_Tx_P, sheet Peripheral Slot 3/MGT_Rx_P
(unnamed): sheet System Slot P1-P5/3_MGT_Tx_N, sheet Peripheral Slot 3/MGT_Rx_N
(unnamed): sheet System Slot P1-P5/3_MGT_Rx_P, sheet Peripheral Slot 3/MGT_Tx_P
(unnamed): sheet System Slot P1-P5/3_MGT_Rx_N, sheet Peripheral Slot 3/MGT_Tx_N
(unnamed): sheet System Slot P1-P5/4_MGT_Tx_P, sheet Peripheral Slot 4/MGT_Rx_P
(unnamed): sheet System Slot P1-P5/4_MGT_Tx_N, sheet Peripheral Slot 4/MGT_Rx_N
(unnamed): sheet System Slot P1-P5/4_MGT_Rx_P, sheet Peripheral Slot 4/MGT_Tx_P
(unnamed): sheet System Slot P1-P5/4_MGT_Rx_N, sheet Peripheral Slot 4/MGT_Tx_N
(unnamed): sheet System Slot P1-P5/5_MGT_Tx_P, sheet Peripheral Slot 5/MGT_Rx_P
(unnamed): sheet System Slot P1-P5/5_MGT_Tx_N, sheet Peripheral Slot 5/MGT_Rx_N
(unnamed): sheet System Slot P1-P5/5_MGT_Rx_P, sheet Peripheral Slot 5/MGT_Tx_P
(unnamed): sheet System Slot P1-P5/5_MGT_Rx_N, sheet Peripheral Slot 5/MGT_Tx_N
(unnamed): sheet System Slot P1-P5/6_MGT_Tx_P, sheet Peripheral Slot 6/MGT_Rx_P
(unnamed): sheet System Slot P1-P5/6_MGT_Tx_N, sheet Peripheral Slot 6/MGT_Rx_N
(unnamed): sheet System Slot P1-P5/6_MGT_Rx_P, sheet Peripheral Slot 6/MGT_Tx_P
(unnamed): sheet System Slot P1-P5/6_MGT_Rx_N, sheet Peripheral Slot 6/MGT_Tx_N
(unnamed): sheet System Slot P1-P5/8_DIFF_10_N, sheet Peripheral Slot 8/DIFF_9_N

Not connected (* = marked no-connect by the designer): B5 1; B6 1; B7 1; B8 1; B9 1; B10 1; B11 1; B12 1; B13 1; B14 1; B15 1; B16 1; B17 1; B18 1; B19 1; B20 1; B21 1; B22 1; B23 1; B24 1; GUIDE1 1; GUIDE2 1; GUIDE3 1; GUIDE4 1; GUIDE5 1; GUIDE6 1; GUIDE7 1; GUIDE8 1; GUIDE9 1

### Buses and harness runs
bus RTM_SHARED_BUS[0..7] = sheet Peripheral Slot 1/RTM_SHARED_BUS[0..7]
bus RTM_SHARED_BUS[0..7] = sheet Peripheral Slot 2/RTM_SHARED_BUS[0..7]
bus RTM_SHARED_BUS[0..7] = sheet Peripheral Slot 3/RTM_SHARED_BUS[0..7]
bus RTM_SHARED_BUS[0..7] = sheet Peripheral Slot 4/RTM_SHARED_BUS[0..7]
bus RTM_SHARED_BUS[0..7] = sheet Peripheral Slot 5/RTM_SHARED_BUS[0..7]
bus RTM_SHARED_BUS[0..7] = sheet Peripheral Slot 6/RTM_SHARED_BUS[0..7]
bus RTM_SHARED_BUS[0..7] = sheet Peripheral Slot 7/RTM_SHARED_BUS[0..7]
bus RTM_SHARED_BUS[0..7] = sheet Peripheral Slot 8/RTM_SHARED_BUS[0..7]
bus RTM_SHARED_BUS[0..7] = sheet Power/RTM_SHARED_BUS[0..7]
bus SHARED_BUS_[0..4] = sheet Peripheral Slot 1/SHARED_BUS_[0..4]
bus SHARED_BUS_[0..4] = sheet Peripheral Slot 2/SHARED_BUS_[0..4]
bus SHARED_BUS_[0..4] = sheet Peripheral Slot 3/SHARED_BUS_[0..4]
bus SHARED_BUS_[0..4] = sheet Peripheral Slot 4/SHARED_BUS_[0..4]
bus SHARED_BUS_[0..4] = sheet Peripheral Slot 5/SHARED_BUS_[0..4]
bus SHARED_BUS_[0..4] = sheet Peripheral Slot 6/SHARED_BUS_[0..4]
bus SHARED_BUS_[0..4] = sheet Peripheral Slot 7/SHARED_BUS_[0..4]
bus SHARED_BUS_[0..4] = sheet Peripheral Slot 8/SHARED_BUS_[0..4]
bus SHARED_BUS_[0..4] = sheet System Slot P1-P5/SHARED_BUS_[0..4]

### Layout directives
differential pair; differential pair class DIFF_MGT_Rx_Tx; net class MGT_Rx_Tx; net class MGT_Rx_Tx: (no net found under the mark)
differential pair; differential pair class DIFF_MGT_Rx_Tx; net class MGT_Rx_Tx: (no net found under the mark)
differential pair; differential pair class DIFF_CLK; net class CLK; net class CLK: (no net found under the mark)
differential pair; differential pair class DIFF_CLK; net class CLK: (no net found under the mark)
differential pair; differential pair class DIFF_SIGNAL; net class SIGNAL; net class SIGNAL: (no net found under the mark)
differential pair; differential pair class DIFF_SIGNAL; net class SIGNAL: 1_DIFF_11_N, 1_DIFF_11_P, 1_DIFF_12_N, 1_DIFF_12_P, 1_DIFF_13_N, 1_DIFF_13_P, 1_DIFF_14_N, 1_DIFF_14_P, 1_DIFF_15_N, 1_DIFF_15_P, 2_DIFF_11_N, 2_DIFF_11_P, 2_DIFF_12_N, 2_DIFF_12_P, 2_DIFF_13_N, 2_DIFF_13_P, 2_DIFF_14_N, 2_DIFF_14_P, 2_DIFF_15_N, 2_DIFF_15_P, 3_DIFF_11_N, 3_DIFF_11_P, 3_DIFF_12_N, 3_DIFF_12_P, 3_DIFF_13_N, 3_DIFF_13_P, 3_DIFF_14_N, 3_DIFF_14_P, 3_DIFF_15_N, 3_DIFF_15_P, 4_DIFF_11_N, 4_DIFF_11_P, 4_DIFF_12_N, 4_DIFF_12_P, 4_DIFF_13_N, 4_DIFF_13_P, 4_DIFF_14_N, 4_DIFF_14_P, 4_DIFF_15_N, 4_DIFF_15_P, 5_DIFF_11_N, 5_DIFF_11_P, 5_DIFF_12_N, 5_DIFF_12_P, 5_DIFF_13_N, 5_DIFF_13_P, 5_DIFF_14_N, 5_DIFF_14_P, 5_DIFF_15_N, 5_DIFF_15_P, 6_DIFF_11_N, 6_DIFF_11_P, 6_DIFF_12_N, 6_DIFF_12_P, 6_DIFF_13_N, 6_DIFF_13_P, 6_DIFF_14_N, 6_DIFF_14_P, 6_DIFF_15_N, 6_DIFF_15_P, 7_DIFF_11_N, 7_DIFF_11_P, 7_DIFF_12_N, 7_DIFF_12_P, 7_DIFF_13_N, 7_DIFF_13_P, 7_DIFF_14_N, 7_DIFF_14_P, 7_DIFF_15_N, 7_DIFF_15_P, 8_DIFF_11_N, 8_DIFF_11_P, 8_DIFF_12_N, 8_DIFF_12_P, 8_DIFF_13_N, 8_DIFF_13_P, 8_DIFF_14_N, 8_DIFF_14_P, 8_DIFF_15_N, 8_DIFF_15_P, (no net found under the mark)

### Notes on the sheet
- Peripheral
  Slot 1
- Peripheral
  Slot 2
- Peripheral
  Slot 3
- Peripheral
  Slot 4
- Peripheral
  Slot 5
- Peripheral
  Slot 6
- Peripheral
  Slot 7
- Peripheral
  Slot 8
- Project/Equipment
- Document
- File
- Designer
- Drawn by
- Check.by
- Last Mod.
- Copyright WUT ISE 2024.
  This documentation describes Open Hardware and is licensed under the CERN OHL-W v.2.0. You may redistribute and modify this documentation under the terms of the CERN OHL-W v.2.0. (http://ohwr.org/CERNOHL). This documentation is distributed WITHOUT ANY EXPRESS OR IMPLIED WARRANTY, INCLUDING OF MERCHANTABILITY, SATISFACTORY QUALITY AND FITNESS FOR A PARTICULAR PURPOSE. Please see the CERN OHL v.2.0 for applicable conditions.
- Contact
- Print Date
- Sheet
- Size
- A2
- of
- Rev

### Library data of the parts
B1-B4 = NON-PLATED_HOLE2.7_PAD5.0_8FCVIAS_BOTSM: Single Terminal Socket; Part Description: Plated Through Hole: Hole Dia.=2.7mm Pad Dia.=5.0mmUnplated Through Hole: Hole Dia.=2.7mm Pad Dia.=5.0mm with 8 vias filled and capped and soldermask on Bottom.; Mounted: No; Part Number: NON-PLATED_HOLE2.7_PAD5.0_8FCVIAS_BOTSM; Component Type: Standard (No BOM); Pin Count: 1; Family: Non Plated Hole; Socket: No; SMD: No; Sense: No; Status: None; ComponentHeight: 0mm; HelpURL: Undefined; Author: CERN DEM WB; CreateDate: 18/04/2024; LatestRevisionDate: 18/04/2024; PackageDescription: Unplated Through Hole: Hole Dia.=2.7mm Pad Dia.=5.0mm with 8 vias filled and capped and soldermask on Bottom.
B5-B24 = NON-PLATED_HOLE2.7: Single Terminal Socket; Part Description: Non Plated Through Hole: Hole Dia.=2.7mm; Mounted: No; Part Number: NON-PLATED_HOLE2.7; Component Type: Standard (No BOM); Pin Count: 1; Family: Non Plated Hole; Socket: No; SMD: No; Sense: No; Status: None; ComponentHeight: 0mm; HelpURL: Undefined; Author: CERN DEM BC; CreateDate: 11.11.2015; LatestRevisionDate: 11.11.2015; PackageDescription: Non Plated Through Hole: Hole Dia.=2.7mm
C1-C12 = CC0402_10NF_16V_10%_X7R: Non-polarised capacitor; Part Description: SMD Multilayer Chip Ceramic Capacitor; Manufacturer: GENERIC; Manufacturer1 Part Number: 223878715636; Voltage: 16V; TC: X7R; Tolerance: ±10%; Part Number: CC0402_10NF_16V_10%_X7R; Component Kind: Standard; Component Type: Standard; Pin Count: 2; Value: 10nF; Status: Not Recommended; Manufacturer Part Number: CC0402_10NF_16V_10%_X7R; Case: 0402; Mounted: Yes; Socket: No; SMD: Yes; Sense: No; Manufacturer1 Example: PHYCOMP; Manufacturer1 ComponentHeight: 0.55mm; HelpURL: \\cern.ch\dfs\Applications\Altium\Datasheets\CC0402_X7R_PHYCOMP.pdf; Author: CERN DEM JLC; CreateDate: 03/12/2007; LatestRevisionDate: 03/12/2007
FTG1-FTG3 = FIDUCIAL_TARGET_c100-200: Fiducial Target; Part Description: Round Fiducial Target, Top Layer, 1.0mm, Top Solder 2.0mm, Keepout =2.0mm; Mounted: No; Part Number: FIDUCIAL_TARGET_C100-200; Component Kind: Standard (No BOM); Component Type: Standard (No BOM); Pin Count: 1; Family: Fiducial; Socket: No; SMD: Yes; Sense: No; Status: None; ComponentHeight: 0mm; HelpURL: Undefined; Author: CERN DEM JLC; CreateDate: 09/02/2010; LatestRevisionDate: 04/04/2012; PackageDescription: Round Fiducial Target, Top Layer, 1.0mm, Top Solder 2.0mm, Keepout =2.0mm
GUIDE1-GUIDE9 = EDA-04126-V1-0: PICMG CompactPCI Serial Backplane Guide Element; Manufacturer: CERN; PressFit: No; Part Number: EDA-04126-V1-0; Component Kind: Standard; Component Type: Standard; Pin Count: 2; PackageDescription: PICMG CompactPCI Serial Backplane Guide Element; Mounted: Yes; Socket: No; SMD: No; Sense: No; Status: None; Value: CPCI-S Guide; Part Description: PICMG CompactPCI Serial Backplane Guide Element; Manufacturer Part Number: EDA-04126-V1-0; ComponentHeight: 32mm; HelpURL: \\cern.ch\dfs\Applications\Altium\Datasheets\EDA-04126-V1-0.pdf; ComponentLink1URL: https://edms.cern.ch/nav/EDA-04126-V1-0; ComponentLink1Description: EDMS Link; Author: CERN DEM BC; CreateDate: 24.09.2019; LatestRevisionDate: 24.09.2019
R1-R20 = R0402_1K_1%_0.0625W_100PPM: Resistor - 1%; Part Description: General Purpose Thick Film Chip Resistor; Manufacturer: GENERIC; Manufacturer1 Part Number: 232270671002L; TC: ±100ppm/°C; PressFit: No; Part Number: R0402_1K_1%_0.0625W_100PPM; Component Kind: Standard; Component Type: Standard; Pin Count: 2; Value: 1k; Status: Not Recommended; Power: 0.0625W; Manufacturer Part Number: R0402_1K_1%_0.0625W_100PPM; Case: 0402; Mounted: Yes; Sense: No; Socket: No; SMD: Yes; Manufacturer1 Example: YAGEO PHYCOMP; Manufacturer1 ComponentHeight: 0.4mm; HelpURL: \\cern.ch\dfs\Applications\Altium\Datasheets\R0402_Phycomp_RC0402.pdf; Author: CERN DEM JLC; CreateDate: 03/12/2007; LatestRevisionDate: 17/10/2012